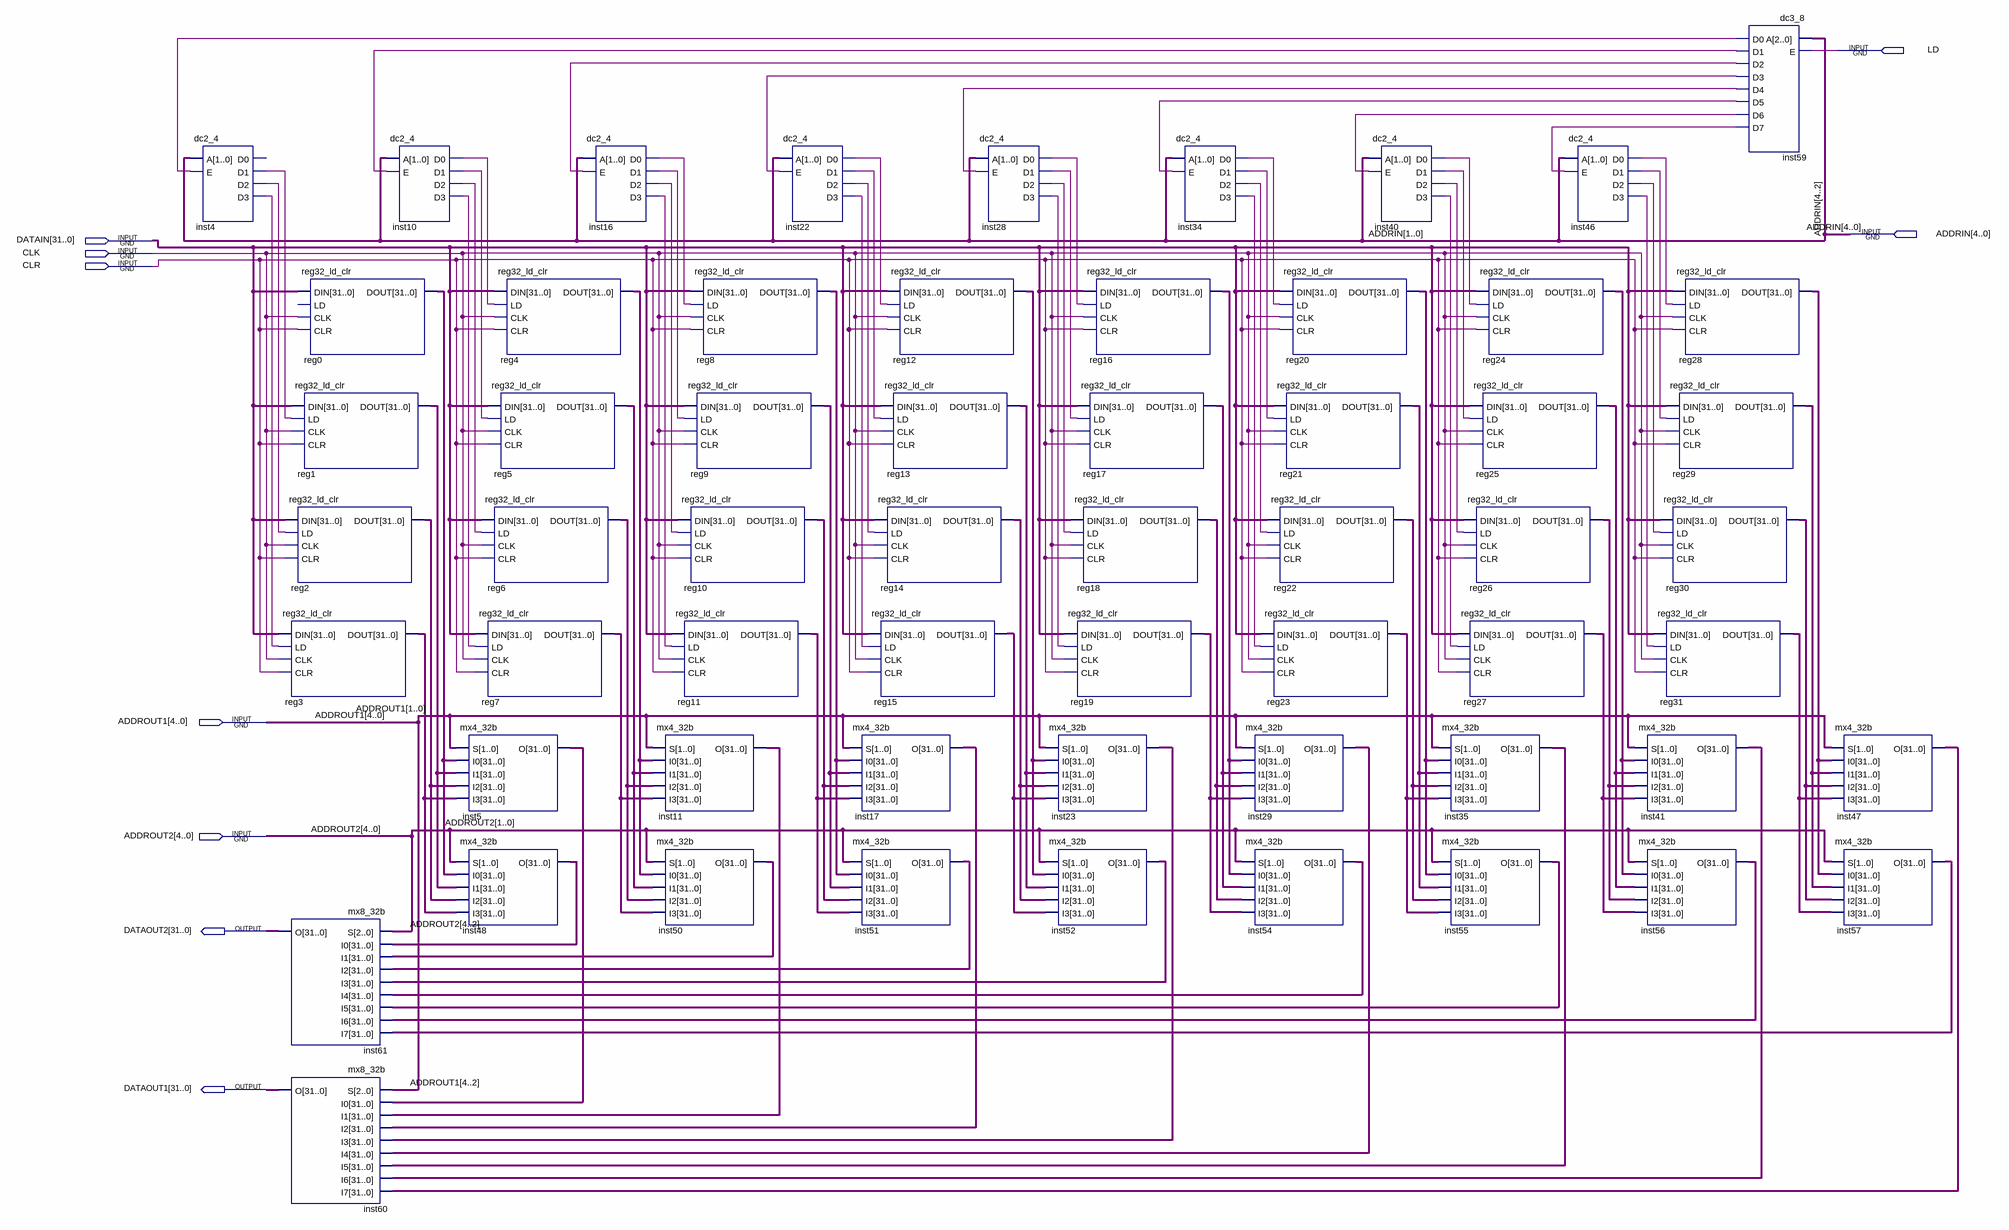
[diagram p0: schematic sheet]
// Quartus schematic regfile.bdf as structural Verilog: 59 symbols, 9 pins
module regfile (
  input  LD,
  input  [4:0] ADDRIN,
  input  [31:0] DATAIN,
  input  CLK,
  input  CLR,
  input  [4:0] ADDROUT1,
  input  [4:0] ADDROUT2,
  output [31:0] DATAOUT2,
  output [31:0] DATAOUT1
);

  wire inst4_d1, inst4_d2, inst4_d3, inst10_d0, inst10_d1, inst10_d2, inst10_d3, inst16_d0, inst16_d1,
       inst16_d2, inst16_d3, inst22_d0, inst22_d1, inst22_d2, inst22_d3, inst28_d0, inst28_d1, inst28_d2,
       inst28_d3, inst34_d0, inst34_d1, inst34_d2, inst34_d3, inst40_d0, inst40_d1, inst40_d2, inst40_d3,
       inst46_d0, inst46_d1, inst46_d2, inst46_d3, inst59_d0, inst59_d1, inst59_d2, inst59_d3, inst59_d4,
       inst59_d5, inst59_d6, inst59_d7;
  wire [31:0] inst5_o, inst11_o, inst17_o, inst23_o, inst29_o, inst35_o, inst41_o, inst47_o, inst48_o,
       inst50_o, inst51_o, inst52_o, inst54_o, inst55_o, inst56_o, inst57_o, reg0_dout, reg1_dout, reg2_dout,
       reg3_dout, reg4_dout, reg5_dout, reg6_dout, reg7_dout, reg8_dout, reg9_dout, reg10_dout, reg11_dout,
       reg12_dout, reg13_dout, reg14_dout, reg15_dout, reg16_dout, reg17_dout, reg18_dout, reg19_dout,
       reg20_dout, reg21_dout, reg22_dout, reg23_dout, reg24_dout, reg25_dout, reg26_dout, reg27_dout,
       reg28_dout, reg29_dout, reg30_dout, reg31_dout;

  dc2_4 inst4 (.A(ADDRIN[1:0]), .E(inst59_d0), .D1(inst4_d1), .D2(inst4_d2), .D3(inst4_d3));  // open: D0
  reg32_ld_clr reg0 (.DIN(DATAIN), .CLK(CLK), .CLR(CLR), .DOUT(reg0_dout));  // open: LD
  reg32_ld_clr reg1 (.DIN(DATAIN), .LD(inst4_d1), .CLK(CLK), .CLR(CLR), .DOUT(reg1_dout));
  reg32_ld_clr reg2 (.DIN(DATAIN), .LD(inst4_d2), .CLK(CLK), .CLR(CLR), .DOUT(reg2_dout));
  reg32_ld_clr reg3 (.DIN(DATAIN), .LD(inst4_d3), .CLK(CLK), .CLR(CLR), .DOUT(reg3_dout));
  mx8_32b inst61 (
    .S(ADDROUT2[4:2]), .I0(inst48_o), .I1(inst50_o), .I2(inst51_o), .I3(inst52_o), .I4(inst54_o),
    .I5(inst55_o), .I6(inst56_o), .I7(inst57_o), .O(DATAOUT2));
  mx8_32b inst60 (
    .S(ADDROUT1[4:2]), .I0(inst5_o), .I1(inst11_o), .I2(inst17_o), .I3(inst23_o), .I4(inst29_o),
    .I5(inst35_o), .I6(inst41_o), .I7(inst47_o), .O(DATAOUT1));
  dc2_4 inst10 (.A(ADDRIN[1:0]), .E(inst59_d1), .D0(inst10_d0), .D1(inst10_d1), .D2(inst10_d2), .D3(inst10_d3));
  mx4_32b inst5 (.S(ADDROUT1[1:0]), .I0(reg0_dout), .I1(reg1_dout), .I2(reg2_dout), .I3(reg3_dout), .O(inst5_o));
  mx4_32b inst48 (.S(ADDROUT2), .I0(reg0_dout), .I1(reg1_dout), .I2(reg2_dout), .I3(reg3_dout), .O(inst48_o));
  reg32_ld_clr reg4 (.DIN(DATAIN), .LD(inst10_d0), .CLK(CLK), .CLR(CLR), .DOUT(reg4_dout));
  reg32_ld_clr reg5 (.DIN(DATAIN), .LD(inst10_d1), .CLK(CLK), .CLR(CLR), .DOUT(reg5_dout));
  reg32_ld_clr reg6 (.DIN(DATAIN), .LD(inst10_d2), .CLK(CLK), .CLR(CLR), .DOUT(reg6_dout));
  reg32_ld_clr reg7 (.DIN(DATAIN), .LD(inst10_d3), .CLK(CLK), .CLR(CLR), .DOUT(reg7_dout));
  dc2_4 inst16 (.A(ADDRIN[1:0]), .E(inst59_d2), .D0(inst16_d0), .D1(inst16_d1), .D2(inst16_d2), .D3(inst16_d3));
  reg32_ld_clr reg11 (.DIN(DATAIN), .LD(inst16_d3), .CLK(CLK), .CLR(CLR), .DOUT(reg11_dout));
  mx4_32b inst11 (.S(ADDROUT1[1:0]), .I0(reg4_dout), .I1(reg5_dout), .I2(reg6_dout), .I3(reg7_dout), .O(inst11_o));
  mx4_32b inst50 (.S(ADDROUT2[1:0]), .I0(reg4_dout), .I1(reg5_dout), .I2(reg6_dout), .I3(reg7_dout), .O(inst50_o));
  reg32_ld_clr reg8 (.DIN(DATAIN), .LD(inst16_d0), .CLK(CLK), .CLR(CLR), .DOUT(reg8_dout));
  reg32_ld_clr reg9 (.DIN(DATAIN), .LD(inst16_d1), .CLK(CLK), .CLR(CLR), .DOUT(reg9_dout));
  reg32_ld_clr reg10 (.DIN(DATAIN), .LD(inst16_d2), .CLK(CLK), .CLR(CLR), .DOUT(reg10_dout));
  dc2_4 inst22 (.A(ADDRIN[1:0]), .E(inst59_d3), .D0(inst22_d0), .D1(inst22_d1), .D2(inst22_d2), .D3(inst22_d3));
  reg32_ld_clr reg14 (.DIN(DATAIN), .LD(inst22_d2), .CLK(CLK), .CLR(CLR), .DOUT(reg14_dout));
  reg32_ld_clr reg15 (.DIN(DATAIN), .LD(inst22_d3), .CLK(CLK), .CLR(CLR), .DOUT(reg15_dout));
  mx4_32b inst17 (.S(ADDROUT1[1:0]), .I0(reg8_dout), .I1(reg9_dout), .I2(reg10_dout), .I3(reg11_dout), .O(inst17_o));
  mx4_32b inst51 (.S(ADDROUT2[1:0]), .I0(reg8_dout), .I1(reg9_dout), .I2(reg10_dout), .I3(reg11_dout), .O(inst51_o));
  reg32_ld_clr reg12 (.DIN(DATAIN), .LD(inst22_d0), .CLK(CLK), .CLR(CLR), .DOUT(reg12_dout));
  reg32_ld_clr reg13 (.DIN(DATAIN), .LD(inst22_d1), .CLK(CLK), .CLR(CLR), .DOUT(reg13_dout));
  dc2_4 inst28 (.A(ADDRIN[1:0]), .E(inst59_d4), .D0(inst28_d0), .D1(inst28_d1), .D2(inst28_d2), .D3(inst28_d3));
  reg32_ld_clr reg17 (.DIN(DATAIN), .LD(inst28_d1), .CLK(CLK), .CLR(CLR), .DOUT(reg17_dout));
  reg32_ld_clr reg18 (.DIN(DATAIN), .LD(inst28_d2), .CLK(CLK), .CLR(CLR), .DOUT(reg18_dout));
  reg32_ld_clr reg19 (.DIN(DATAIN), .LD(inst28_d3), .CLK(CLK), .CLR(CLR), .DOUT(reg19_dout));
  mx4_32b inst23 (.S(ADDROUT1[1:0]), .I0(reg12_dout), .I1(reg13_dout), .I2(reg14_dout), .I3(reg15_dout), .O(inst23_o));
  mx4_32b inst52 (.S(ADDROUT2[1:0]), .I0(reg12_dout), .I1(reg13_dout), .I2(reg14_dout), .I3(reg15_dout), .O(inst52_o));
  reg32_ld_clr reg16 (.DIN(DATAIN), .LD(inst28_d0), .CLK(CLK), .CLR(CLR), .DOUT(reg16_dout));
  dc2_4 inst34 (.A(ADDRIN[1:0]), .E(inst59_d5), .D0(inst34_d0), .D1(inst34_d1), .D2(inst34_d2), .D3(inst34_d3));
  reg32_ld_clr reg20 (.DIN(DATAIN), .LD(inst34_d0), .CLK(CLK), .CLR(CLR), .DOUT(reg20_dout));
  reg32_ld_clr reg21 (.DIN(DATAIN), .LD(inst34_d1), .CLK(CLK), .CLR(CLR), .DOUT(reg21_dout));
  reg32_ld_clr reg22 (.DIN(DATAIN), .LD(inst34_d2), .CLK(CLK), .CLR(CLR), .DOUT(reg22_dout));
  reg32_ld_clr reg23 (.DIN(DATAIN), .LD(inst34_d3), .CLK(CLK), .CLR(CLR), .DOUT(reg23_dout));
  mx4_32b inst29 (.S(ADDROUT1[1:0]), .I0(reg16_dout), .I1(reg17_dout), .I2(reg18_dout), .I3(reg19_dout), .O(inst29_o));
  mx4_32b inst54 (.S(ADDROUT2[1:0]), .I0(reg16_dout), .I1(reg17_dout), .I2(reg18_dout), .I3(reg19_dout), .O(inst54_o));
  dc2_4 inst40 (.A(ADDRIN[1:0]), .E(inst59_d6), .D0(inst40_d0), .D1(inst40_d1), .D2(inst40_d2), .D3(inst40_d3));
  reg32_ld_clr reg24 (.DIN(DATAIN), .LD(inst40_d0), .CLK(CLK), .CLR(CLR), .DOUT(reg24_dout));
  reg32_ld_clr reg25 (.DIN(DATAIN), .LD(inst40_d1), .CLK(CLK), .CLR(CLR), .DOUT(reg25_dout));
  reg32_ld_clr reg26 (.DIN(DATAIN), .LD(inst40_d2), .CLK(CLK), .CLR(CLR), .DOUT(reg26_dout));
  reg32_ld_clr reg27 (.DIN(DATAIN), .LD(inst40_d3), .CLK(CLK), .CLR(CLR), .DOUT(reg27_dout));
  mx4_32b inst35 (.S(ADDROUT1[1:0]), .I0(reg20_dout), .I1(reg21_dout), .I2(reg22_dout), .I3(reg23_dout), .O(inst35_o));
  mx4_32b inst55 (.S(ADDROUT2[1:0]), .I0(reg20_dout), .I1(reg21_dout), .I2(reg22_dout), .I3(reg23_dout), .O(inst55_o));
  dc2_4 inst46 (.A(ADDRIN), .E(inst59_d7), .D0(inst46_d0), .D1(inst46_d1), .D2(inst46_d2), .D3(inst46_d3));
  mx4_32b inst41 (.S(ADDROUT1[1:0]), .I0(reg24_dout), .I1(reg25_dout), .I2(reg26_dout), .I3(reg27_dout), .O(inst41_o));
  mx4_32b inst56 (.S(ADDROUT2[1:0]), .I0(reg24_dout), .I1(reg25_dout), .I2(reg26_dout), .I3(reg27_dout), .O(inst56_o));
  reg32_ld_clr reg28 (.DIN(DATAIN), .LD(inst46_d0), .CLK(CLK), .CLR(CLR), .DOUT(reg28_dout));
  reg32_ld_clr reg29 (.DIN(DATAIN), .LD(inst46_d1), .CLK(CLK), .CLR(CLR), .DOUT(reg29_dout));
  reg32_ld_clr reg30 (.DIN(DATAIN), .LD(inst46_d2), .CLK(CLK), .CLR(CLR), .DOUT(reg30_dout));
  reg32_ld_clr reg31 (.DIN(DATAIN), .LD(inst46_d3), .CLK(CLK), .CLR(CLR), .DOUT(reg31_dout));
  dc3_8 inst59 (
    .A(ADDRIN[4:2]), .E(LD), .D0(inst59_d0), .D1(inst59_d1), .D2(inst59_d2), .D3(inst59_d3), .D4(inst59_d4),
    .D5(inst59_d5), .D6(inst59_d6), .D7(inst59_d7));
  mx4_32b inst47 (.S(ADDROUT1[1:0]), .I0(reg28_dout), .I1(reg29_dout), .I2(reg30_dout), .I3(reg31_dout), .O(inst47_o));
  mx4_32b inst57 (.S(ADDROUT2[1:0]), .I0(reg28_dout), .I1(reg29_dout), .I2(reg30_dout), .I3(reg31_dout), .O(inst57_o));
endmodule
